# EasyEDA schematic SCH_ESP32-WROOM_2022-01-13.json
TITLE: Sheet_1; REV: 1.0; Date: 2022-01-01; Sheet: 1/1; Drawn By: WIE; Company: WIE
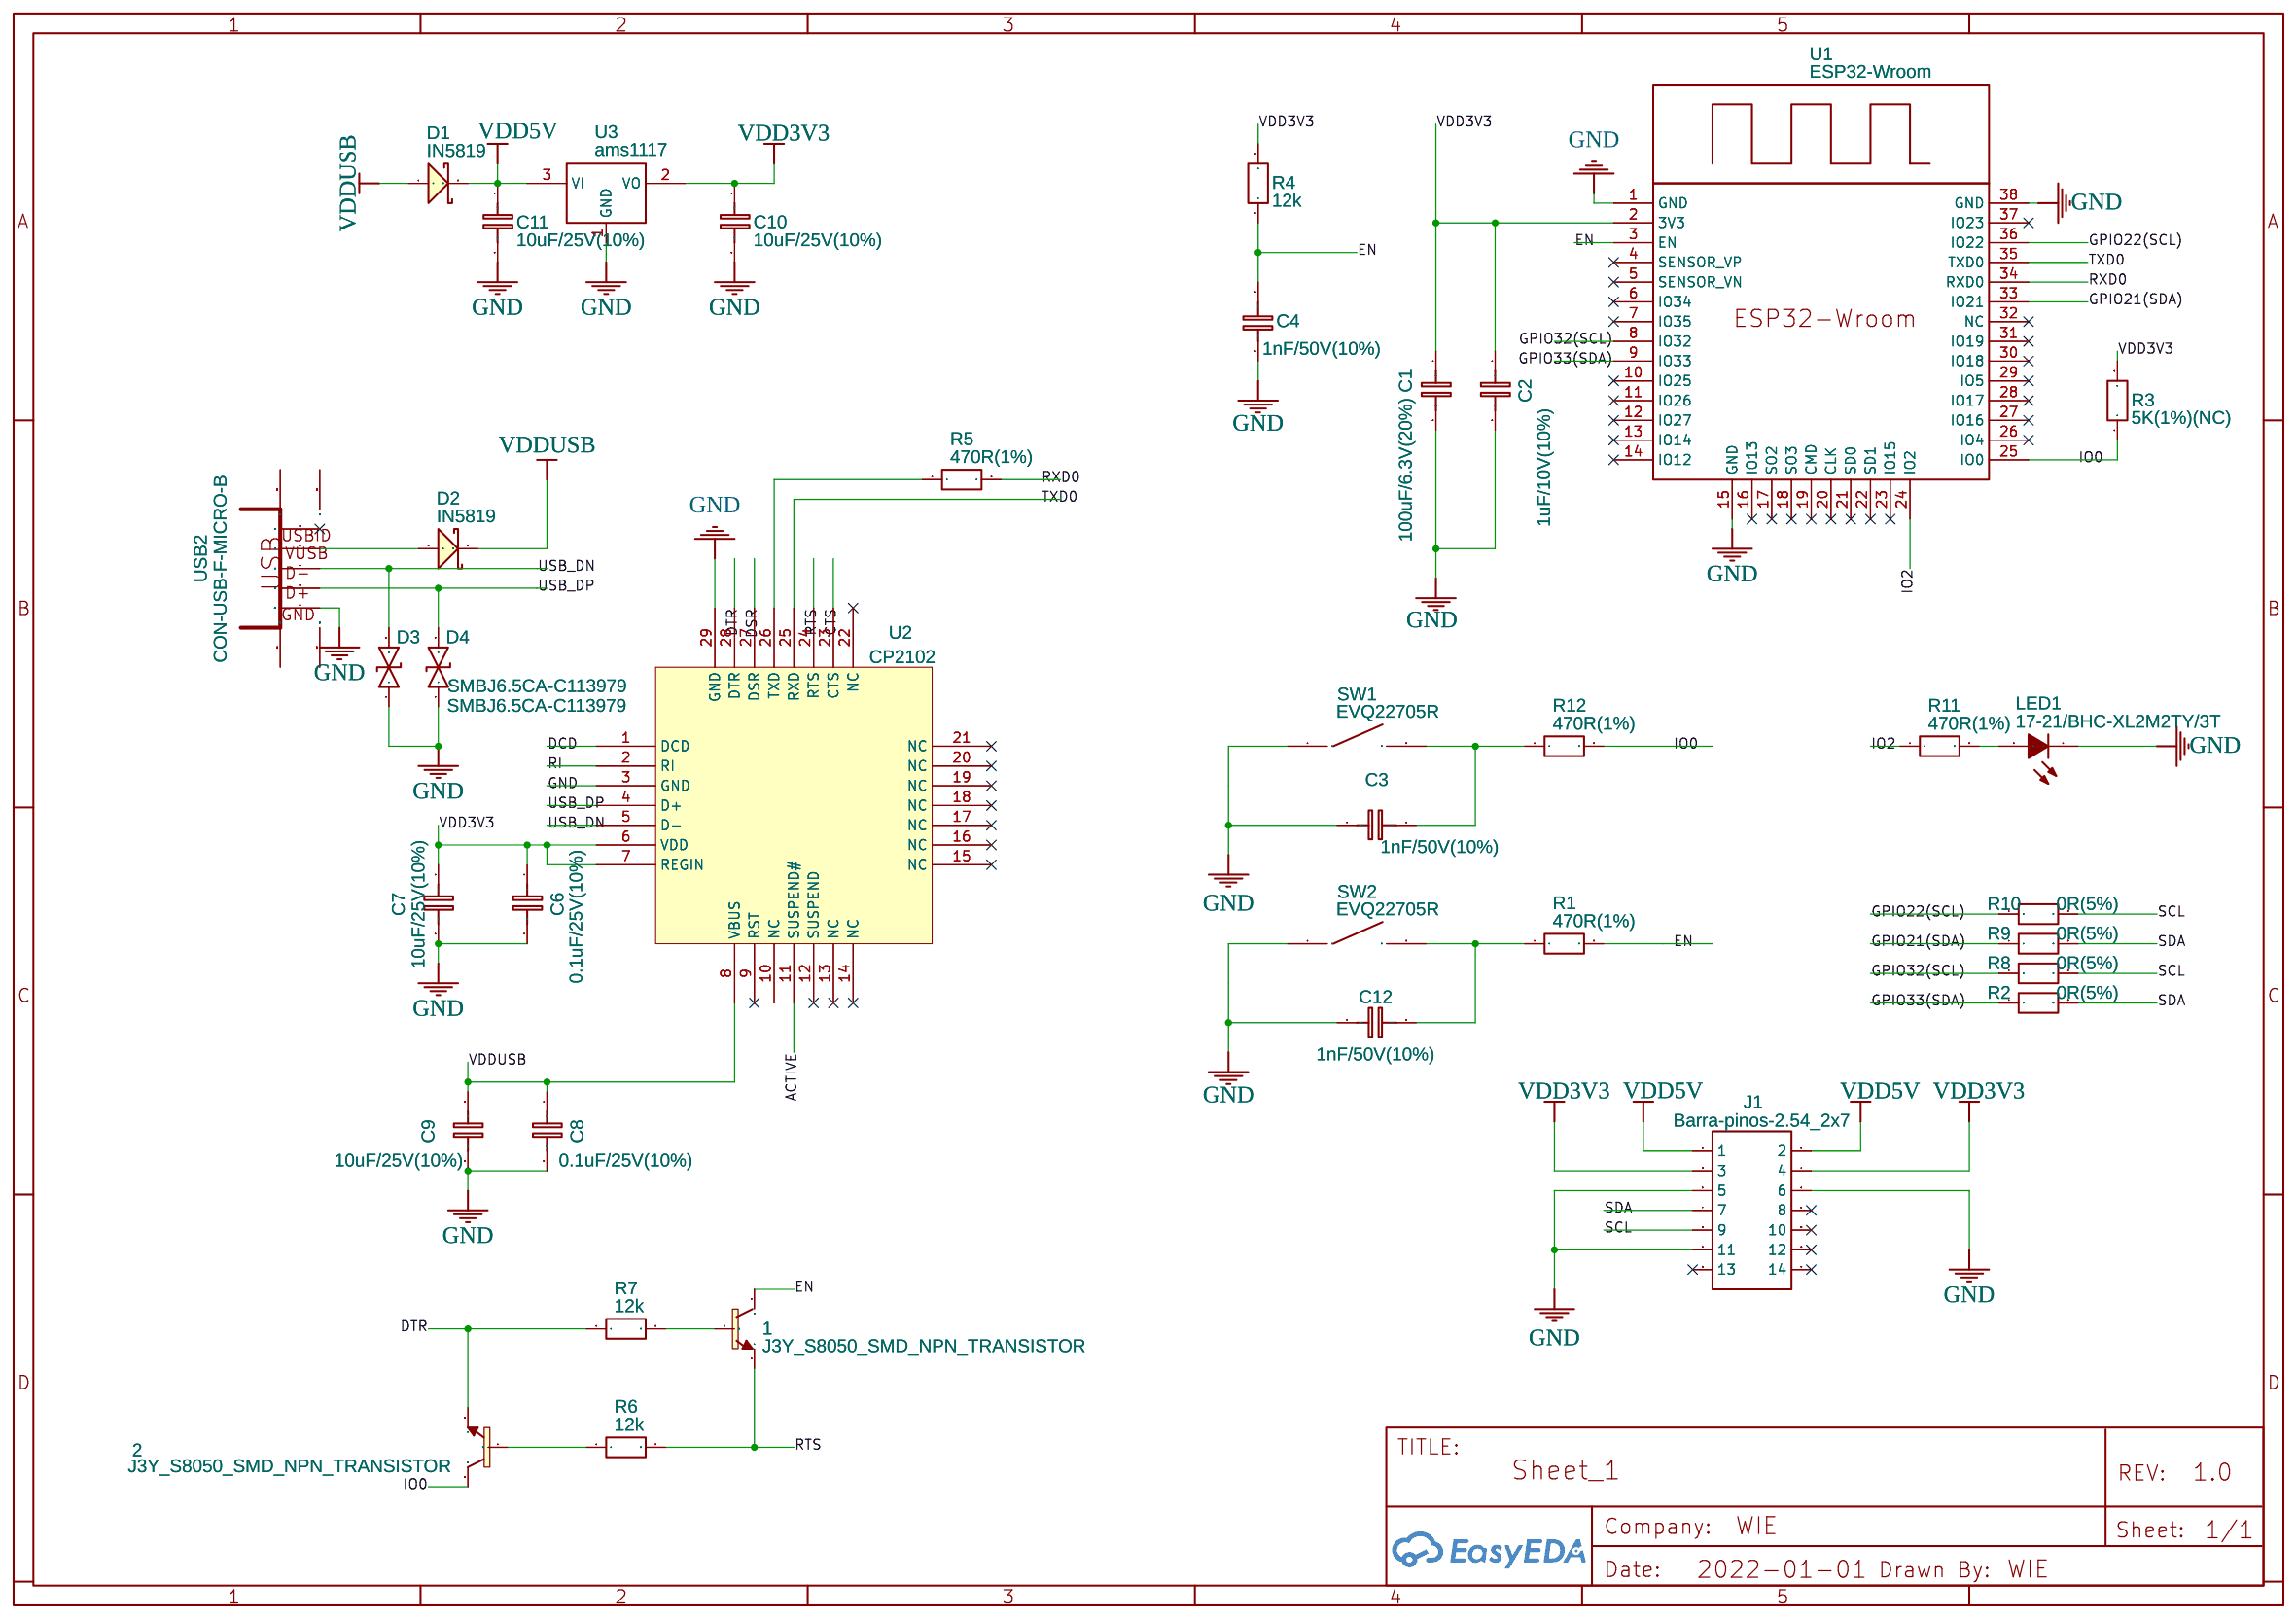
[diagram p0: schematic sheet]

## Parts
1  J3Y_S8050_SMD_NPN_TRANSISTOR  [SOT-23-3]
2  J3Y_S8050_SMD_NPN_TRANSISTOR  [SOT-23-3]
C1  100uF/6.3V(20%)  [0805]
C2  1uF/10V(10%)  [0805]
C3  1nF/50V(10%)  [0805]
C4  1nF/50V(10%)  [0805]
C6  0.1uF/25V(10%)  [0805]
C7  10uF/25V(10%)  [0805]
C8  0.1uF/25V(10%)  [0805]
C9  10uF/25V(10%)  [0805]
C10  10uF/25V(10%)  [0805]
C11  10uF/25V(10%)  [0805]
C12  1nF/50V(10%)  [0805]
D1  IN5819  [SMA/DO-214AC]
D2  IN5819  [SMA/DO-214AC]
D3  SMBJ6.5CA-C113979  [SMB_L4.6-W3.6-LS5.3-BI]
D4  SMBJ6.5CA-C113979  [SMB_L4.6-W3.6-LS5.3-BI]
J1  Barra-pinos-2.54_2x7  [BARRA-PINOS-2.54_2X7-SHAPE]
LED1  17-21/BHC-XL2M2TY/3T  [LED0805-RD]
R1  470R(1%)  [0805]
R2  0R(5%)  [0805]
R3  5K(1%)(NC)  [0805]
R4  12k  [0805]
R5  470R(1%)  [0805]
R6  12k  [0805]
R7  12k  [0805]
R8  0R(5%)  [0805]
R9  0R(5%)  [0805]
R10  0R(5%)  [0805]
R11  470R(1%)  [0805]
R12  470R(1%)  [0805]
SW1  EVQ22705R  [KEY-6.0*6.0-4]
SW2  EVQ22705R  [KEY-6.0*6.0-4]
U1  ESP32-Wroom  [ESP32_WROOM_FOOTPRINT]
U2  CP2102  [CP2102]
U3  ams1117  [AMS1117]
USB2  CON-USB-F-MICRO-B  [CONN_USB_MICRO-B]

## Library data of the parts
1 2 = J3Y_S8050_SMD_NPN_TRANSISTOR: Contributor: Tomaž Pačnik
C1-C4 C6-C12 = Cap_0805_EU
D1 D2 = IN5819
D3 D4 = SMBJ6.5CA-C113979: Supplier: LCSC; Manufacturer: MDD; Manufacturer Part: SMBJ6.5CA; Supplier Part: C113979; LCSC Assembly: Yes; SMT Type: Extend
J1 = Barra-pinos-2.54_2x7: Manufacturer: BOOMELE; Manufacturer Part: Double row of needle2X7P 2.54mm; Supplier Part: C71397; Contributor: Plinio Morales
LED1 = 17-21/BHC-XL2M2TY/3T: Supplier: LCSC; Manufacturer: EVERLIGHT; image: //image.lceda.cn/szlcsc/C72035.jpg; Supplier Part: C72035; LCSC Assembly: Yes; SMT Type: Extend
R1-R12 = Res_0805(1/8W)_EU
SW1 SW2 = -: Supplier: LCSC; Manufacturer: PANASONIC; Contributor: LCSC; Supplier Part: C79156
U1 = ESP32-Wroom: Contributor: cunt123
U2 = CP2102: Contributor: Sky92033
U3 = ams1117: sourceId: _OoGYgCK2k
USB2 = CON-USB-F-MICRO-B: USB Female connector; Contributor: Sky92033

## Nets
GND: C1.2 C2.2 C3.1 C4.1 C6.2 C7.2 C8.2 C9.2 C10.2 C11.2 C12.1 D3.1 D4.1 J1.5 J1.6 J1.11 LED1.1(-) SW1.1 SW2.1 U1.1(GND) U1.15(GND) U1.38(GND) U2.3(GND) U2.29(GND) U3.1(GND) USB2.P4(USBID)
VDD3V3: C1.1 C2.1 C6.1 C7.1 C10.1 J1.3 J1.4 R3.2 R4.2 U1.2(3V3) U2.6(VDD) U2.7(REGIN) U3.2(VO)
VDD5V: C11.1 D1.2 J1.1 J1.2 U3.3(VI)
VDDUSB: C8.1 C9.1 D1.1 D2.2 U2.8(VBUS)
ACTIVE: U2.11(SUSPEND#)
CTS: U2.23(CTS)
DCD: U2.1(DCD)
DSR: U2.27(DSR)
DTR: 2.3(E) R7.1 U2.28(DTR)
EN: 1.2(C) C4.2 R1.2 R4.1 U1.3(EN)
GPIO21(SDA): R9.1 U1.33(IO21)
GPIO22(SCL): R10.1 U1.36(IO22)
GPIO32(SCL): R8.1 U1.8(IO32)
GPIO33(SDA): R2.1 U1.9(IO33)
IO0: 2.2(C) R3.1 R12.2 U1.25(IO0)
IO2: R11.1 U1.24(IO2)
RI: U2.2(RI)
RTS: 1.3(E) R6.2 U2.24(RTS)
RXD0: R5.2 U1.34(RXD0)
SCL: J1.9 R8.2 R10.2
SDA: J1.7 R2.2 R9.2
TXD0: U1.35(TXD0) U2.25(RXD)
USB_DN: D3.2 U2.5(D-) USB2.P2(D-)
USB_DP: D4.2 U2.4(D+) USB2.P3(D+)
Net-(1-1): 1.1(B) R7.2
Net-(2-1): 2.1(B) R6.1
Net-(C3-2): C3.2 R12.1 SW1.2
Net-(C12-2): C12.2 R1.1 SW2.2
Net-(D2-1): D2.1 USB2.P1(VUSB)
Net-(LED1-2): LED1.2(+) R11.2
Net-(R5-1): R5.1 U2.26(TXD)

Not connected (* = marked no-connect by the designer): J1 8* 10* 12* 13* 14*; U1 4(SENSOR_VP)* 5(SENSOR_VN)* 6(IO34)* 7(IO35)* 10(IO25)* 11(IO26)* 12(IO27)* 13(IO14)* 14(IO12)* 16(IO13)* 17(SO2)* 18(SO3)* 19(CMD)* 20(CLK)* 21(SD0)* 22(SD1)* 23(IO15)* 26(IO4)* 27(IO16)* 28(IO17)* 29(IO5)* 30(IO18)* 31(IO19)* 32(NC)* 37(IO23)*; U2 9(RST)* 10(NC) 12(SUSPEND)* 13(NC)* 14(NC)* 15(NC)* 16(NC)* 17(NC)* 18(NC)* 19(NC)* 20(NC)* 21(NC)* 22(NC)*; USB2 BODY@1(BODY) BODY@2(BODY) BODY@3(BODY) BODY@4(BODY) P5(GND)*
